# Altium project canopy_cam.PrjPCB
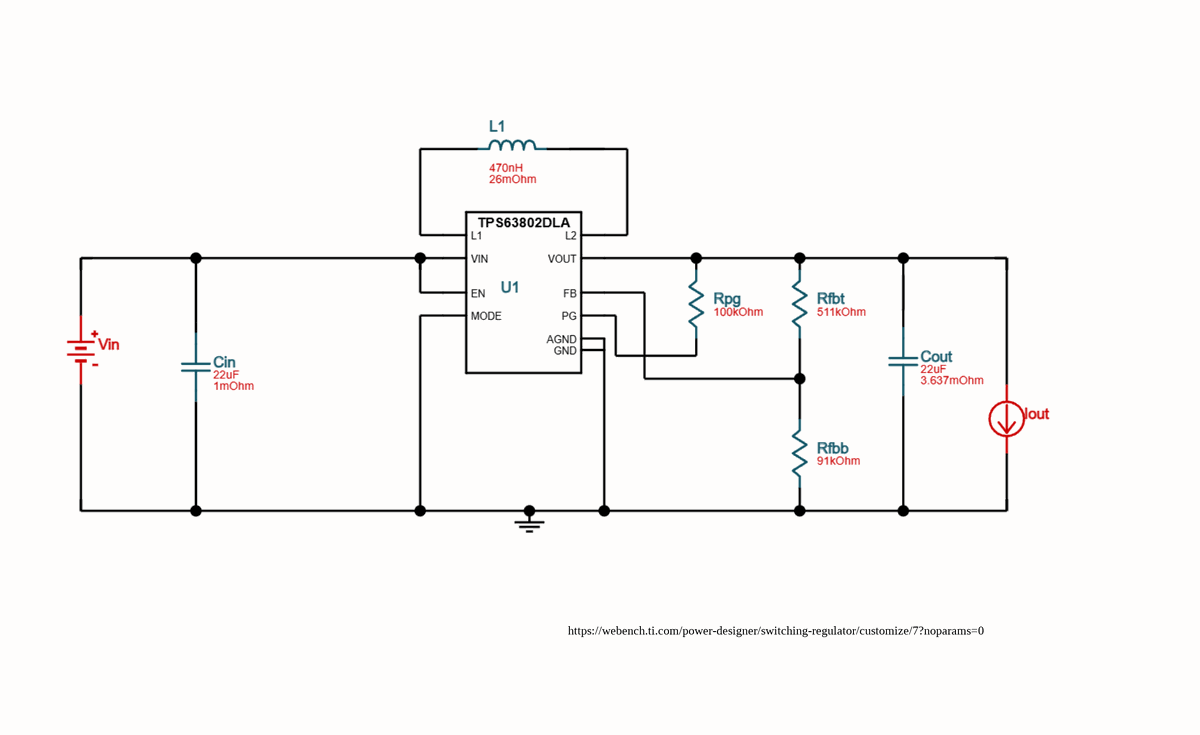
[diagram p0: solar_power.SchDoc, left]
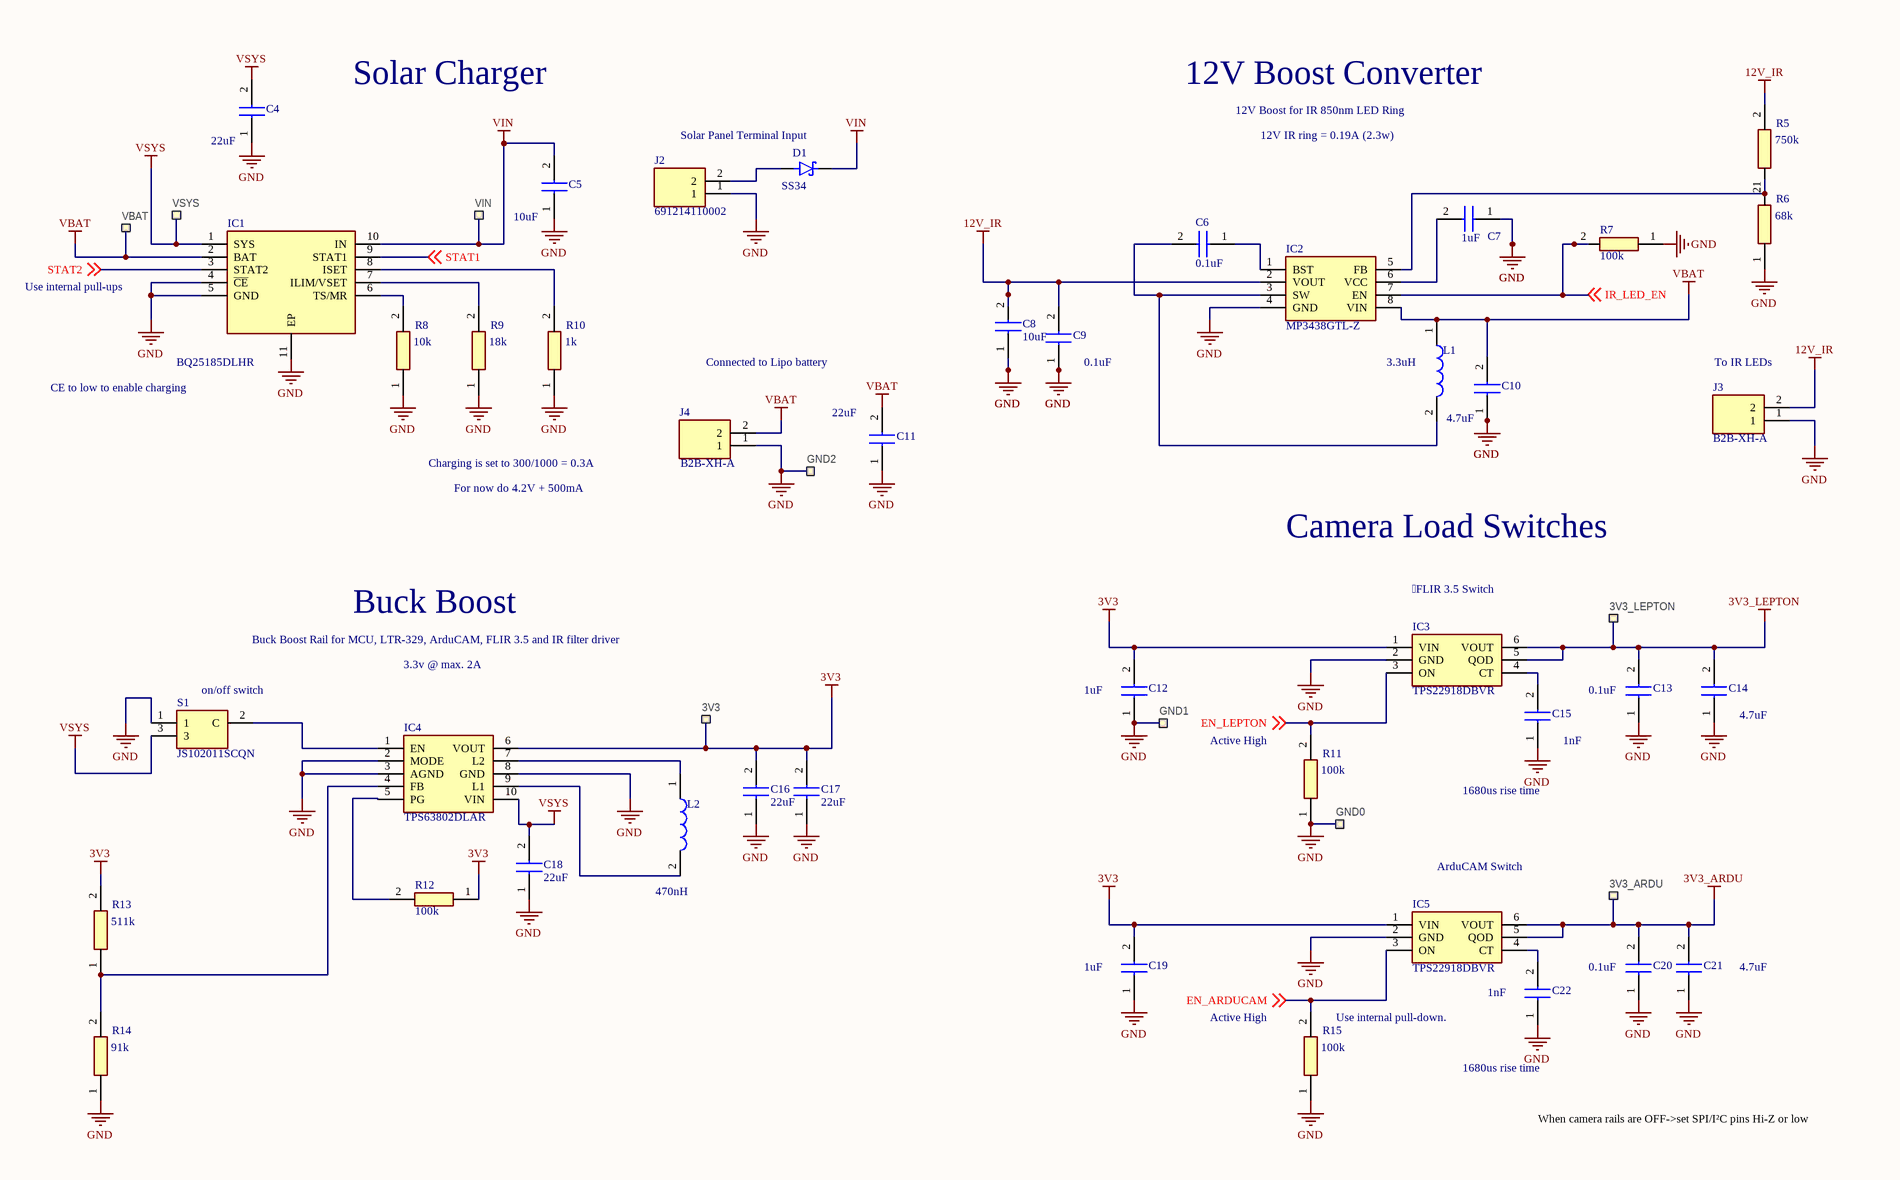
[diagram p1: solar_power.SchDoc, right]
BoardThickness: 1.6mm; BoardTitle: nRF52840 Development Board; Classification: Public; Compliance: RoHS, REACH, Halogen-Free; Designer: MASI/RUBR/STL1/RSK; Dielectric: FR-4 Halogen-Free; NrOfLayers: 4; Organization: Nordic Semiconductor; PCAName: PCA10056; PCARevision: 3.0.3; PCBNumber: 400236; PCBRevision: 0461RUBR; PCBStackup: 4001: Standard 1.6mm 1oz; ProductName: nRF52840-DK; ProjectName: nRF52840-DK; ProjectNumber: 4440; SilkscreenColor: White; SoldermaskColor: Blue; SurfaceFinish: ENIG
3 sheets, 70 parts. Net scope: flat (ports and power ports of the same name join across sheets).
Board file: canopy_cam.PcbDoc
Sheets:
  solar_power.SchDoc
  connectors.SchDoc
  nRF52840.SchDoc

## Sheet solar_power.SchDoc
size B

### Parts
3V3  Ø1.0mm,SMD  [TP_SMD_D1.0mm]  (value not drawn)  (no BOM)
3V3_ARDU  Ø1.0mm,SMD  [TP_SMD_D1.0mm]  (value not drawn)  (no BOM)
3V3_LEPTON  Ø1.0mm,SMD  [TP_SMD_D1.0mm]  (value not drawn)  (no BOM)
C4  22uF  [CAPC2114X95N]
C5  10uF  [CAPC2114X95N]
C6  0.1uF  [CAPC1608X90N]
C7  1uF  [CAPC1608X90N]
C8  10uF  [CAPC2114X95N]
C9  0.1uF  [CAPC1608X90N]
C10  4.7uF  [CAPC2114X95N]
C11  22uF  [CAPC2114X95N]
C12  1uF  [CAPC1608X90N]
C13  0.1uF  [CAPC1608X90N]
C14  4.7uF  [CAPC1608X90N]
C15  1nF  [CAPC1608X90N]
C16  22uF  [CAPC2114X95N]
C17  22uF  [CAPC2114X95N]
C18  22uF  [CAPC2114X95N]
C19  1uF  [CAPC1608X90N]
C20  0.1uF  [CAPC1608X90N]
C21  4.7uF  [CAPC1608X90N]
C22  1nF  [CAPC1608X90N]
D1  SS34  [DIOM7959X265N]
GND0  Ø1.0mm,SMD  [TP_SMD_D1.0mm]  (value not drawn)  (no BOM)
GND1  Ø1.0mm,SMD  [TP_SMD_D1.0mm]  (value not drawn)  (no BOM)
GND2  Ø1.0mm,SMD  [TP_SMD_D1.0mm]  (value not drawn)  (no BOM)
IC1  BQ25185DLHR  [SON40P220X200X80-11N]
IC2  MP3438GTL-Z  [SOTFL50P160X60-8N]
IC3  TPS22918DBVR  [SOT95P280X145-6N]
IC4  TPS63802DLAR  [TPS63802DLAR]
IC5  TPS22918DBVR  [SOT95P280X145-6N]
J2  691214110002  [691214110002]
J3  B2B-XH-A  [SHDR2W64P0X250_1X2_740X575X700P]
J4  B2B-XH-A  [SHDR2W64P0X250_1X2_740X575X700P]
L1  3.3uH  [MPLAL40203R3]
L2  470nH  [1285ASH1R0MP2]
R5  750k  [RESC1608X55N]
R6  68k  [RESC1608X55N]
R7  100k  [RESC1608X55N]
R8  10k  [RESC1608X55N]
R9  18k  [RESC1608X55N]
R10  1k  [RESC1608X55N]
R11  100k  [RESC1608X55N]
R12  100k  [RESC1608X55N]
R13  511k  [RESC1608X55N]
R14  91k  [RESC1608X55N]
R15  100k  [RESC1608X55N]
S1  JS102011SCQN  [JS102011SCQN]
VBAT  Ø1.0mm,SMD  [TP_SMD_D1.0mm]  (value not drawn)  (no BOM)
VIN  Ø1.0mm,SMD  [TP_SMD_D1.0mm]  (value not drawn)  (no BOM)
VSYS  Ø1.0mm,SMD  [TP_SMD_D1.0mm]  (value not drawn)  (no BOM)

### Nets
3V3: 3V3.1 C12.2 C16.2 C17.2 C19.2 IC3.1(VIN) IC4.6(VOUT) IC5.1(VIN) R12.1 R13.2
3V3_ARDU: 3V3_ARDU.1 C20.2 C21.2 IC5.5(QOD) IC5.6(VOUT)
3V3_LEPTON: 3V3_LEPTON.1 C13.2 C14.2 IC3.5(QOD) IC3.6(VOUT)
12V_IR: C8.2 C9.2 IC2.2(VOUT) J3.2 R5.2
GND: C4.1 C5.1 C7.1 C8.1 C9.1 C10.1 C11.1 C12.1 C13.1 C14.1 C15.1 C16.1 C17.1 C18.1 C19.1 C20.1 C21.1 C22.1 GND0.1 GND1.1 GND2.1 IC1.4(~{CE}) IC1.5(GND) IC1.11(EP) IC2.4(GND) IC3.2(GND) IC4.2(MODE) IC4.3(AGND) IC4.8(GND) IC5.2(GND) J2.1 J3.1 J4.1 R6.1 R7.1 R8.1 R9.1 R10.1 R11.1 R14.1 R15.1 S1.1
VBAT: C10.2 C11.2 IC1.2(BAT) IC2.8(VIN) J4.2 L1.1 VBAT.1
VIN: C5.2 D1.C(K) IC1.10(IN) VIN.1
VSYS: C4.2 C18.2 IC1.1(SYS) IC4.10(VIN) S1.3 VSYS.1
EN_ARDUCAM: IC5.3(ON) R15.2 ; off-sheet EN_ARDUCAM  [project net P0.30]
EN_LEPTON: IC3.3(ON) R11.2 ; off-sheet EN_LEPTON  [project net P0.03]
IR_LED_EN: IC2.7(EN) R7.2 ; off-sheet IR_LED_EN  [project net P0.31]
STAT1: IC1.9(STAT1) ; off-sheet STAT1  [project net P0.28]
STAT2: IC1.3(STAT2) ; off-sheet STAT2  [project net P0.02]
NetC6_1: C6.1 IC2.1(BST)
NetC6_2: C6.2 IC2.3(SW) L1.2
NetC7_2: C7.2 IC2.6(VCC)
NetC15_2: C15.2 IC3.4(CT)
NetC22_2: C22.2 IC5.4(CT)
NetD1_A: D1.A J2.2
NetIC1_6: IC1.6(TS/MR) R8.2
NetIC1_7: IC1.7(ILIM/VSET) R9.2
NetIC1_8: IC1.8(ISET) R10.2
NetIC2_5: IC2.5(FB) R5.1 R6.2
NetIC4_1: IC4.1(EN) S1.2(C)
NetIC4_4: IC4.4(FB) R13.1 R14.2
NetIC4_5: IC4.5(PG) R12.2
NetIC4_7: IC4.7(L2) L2.1
NetIC4_9: IC4.9(L1) L2.2

### Notes on the sheet
- Solar Charger
- Solar Panel Terminal Input
- 12V Boost Converter
- 12V Boost for IR 850nm LED Ring
- 12V IR ring = 0.19A (2.3w)
- Use internal pull-ups
- (near IC1) CE to low to enable charging
- Connected to Lipo battery
- (near J3) To IR LEDs
- Charging is set to 300/1000 = 0.3A
- For now do 4.2V + 500mA
- Camera Load Switches
- Buck Boost Rail for MCU, LTR-329, ArduCAM, FLIR 3.5 and IR filter driver
- Buck Boost
- (near IC3) FLIR 3.5 Switch
- (near S1) on/off switch
- 3.3v @ max. 2A
- Active High
- 1680us rise time
- (near IC5) ArduCAM Switch
- https://webench.ti.com/power-designer/switching-regulator/customize/7?noparams=0
- (near R15) Active High
- (near R15) Use internal pull-down.
- When camera rails are OFF->set SPI/I²C pins Hi-Z or low

### Library data of the parts
3V3 3V3_ARDU 3V3_LEPTON GND0-GND2 VBAT VIN VSYS = TP_SMD_Ø1.0MM: 1.0mm circular SMD testpad; Manufacturer: Nordic Semiconductor; Manufacturer Part Number: N.A.; Part number NEMS: 100500475; Pad Count: 1; Component Status: Active; Part Number: TP_SMD_Ø1.0MM; LatestRevisionDate: 2021-03-05; Published: 2013-06-11; Value: Ø1.0mm,SMD; Note: N.A.; Artikkelnr Noca: N.A.; Footprint Doc: TP_SMD_Ø1.0mm; Part number IPS: N.A.; ComponentLink1URL: N.A.; ComponentLink1Description: Datasheet; ComponentLink2URL: N.A.; ComponentLink2Description: Supplier link; HelpURL: N.A.; Supplier 1: N.A.; Supplier Part Number 1: N.A.; Supplier 2: N.A.; Supplier Part Number 2: N.A.; Author: rsk; Component Class: Connectors; PartId: 100500475; Part number Norautron: N.A.
C4 C5 C8 C10 C11 C16-C18 = MSASL219LB5226MTNA01: MSASL219LB5226MTNA01 0805 CAP 25V; Manufacturer_Name: TAIYO YUDEN; Datasheet Link: https://4donline.ihs.com/images/VipMasterIC/IC/TAIY/TAIY-S-A0026212580/TAIY-S-A0026212609-1.pdf?hkey=61A2E4C270F0397D049F8F05BD4F1054; Height: 0.95mm; Manufacturer_Part_Number: MSASL219LB5226MTNA01
C6 C7 C9 C12-C14 C19-C21 = CC0603KRX7R0BB104: 0603 CAP X5R 25V; Manufacturer_Name: YAGEO; Datasheet Link: https://www.yageo.com/upload/media/product/products/datasheet/mlcc/UPY-NP0X7R_MV_100-to-630V_21.pdf; Height: 0.9mm; Manufacturer_Part_Number: CC0603KRX7R0BB104; Mouser Part Number: 603-CC603KRX7R0BB104; Mouser Price/Stock: https://www.mouser.co.uk/ProductDetail/YAGEO/CC0603KRX7R0BB104?qs=5eucE5Hus%252BjO6dm3Y8T6pg%3D%3D; Arrow Part Number: CC0603KRX7R0BB104; Arrow Price/Stock: https://www.arrow.com/en/products/cc0603krx7r0bb104/yageo?region=nac
C15 C22 = CC0603KRX7R0BB104: 0603 CAP X5R 50V; Manufacturer_Name: YAGEO; Datasheet Link: https://www.yageo.com/upload/media/product/products/datasheet/mlcc/UPY-NP0X7R_MV_100-to-630V_21.pdf; Height: 0.9mm; Manufacturer_Part_Number: CC0603KRX7R0BB104; Mouser Part Number: 603-CC603KRX7R0BB104; Mouser Price/Stock: https://www.mouser.co.uk/ProductDetail/YAGEO/CC0603KRX7R0BB104?qs=5eucE5Hus%252BjO6dm3Y8T6pg%3D%3D; Arrow Part Number: CC0603KRX7R0BB104; Arrow Price/Stock: https://www.arrow.com/en/products/cc0603krx7r0bb104/yageo?region=nac
D1 = SS34: Diode Schottky 40 V 3A Surface Mount SMC (DO-214AB); MF: onsemi; SnapEDA_Link: https://www.snapeda.com/parts/SS34/Onsemi/view-part/?ref=snap; Package: SMC-2 ON Semiconductor; Value: *; MP: SS34; Check_prices: https://www.snapeda.com/parts/SS34/Onsemi/view-part/?ref=eda
IC1 = BQ25185DLHR: Integrated Circuit; Manufacturer_Name: Texas Instruments; Datasheet Link: https://www.ti.com/lit/ds/symlink/bq25185.pdf?ts=1706857561339&ref_url=https%253A%252F%252Fwww.ti.com%252Fproduct%252FBQ25185; Height: 0.8mm; Manufacturer_Part_Number: BQ25185DLHR; Mouser Part Number: 595-BQ25185DLHR; Mouser Price/Stock: https://www.mouser.co.uk/ProductDetail/Texas-Instruments/BQ25185DLHR?qs=Z%252BL2brAPG1IbO%2FV3RqsaPw%3D%3D
IC2 = MP3438GTL-Z: Integrated Circuit; Manufacturer_Name: Monolithic Power Systems (MPS); Datasheet Link: https://www.monolithicpower.com/en/documentview/productdocument/index/version/2/document_type/Datasheet/lang/en/sku/MP3438GTL/; Height: 0.6mm; Manufacturer_Part_Number: MP3438GTL-Z; Mouser Part Number: 946-MP3438GTL-Z; Mouser Price/Stock: https://www.mouser.co.uk/ProductDetail/Monolithic-Power-Systems-MPS/MP3438GTL-Z?qs=tlsG%2FOw5FFjfFO8TaWv5UA%3D%3D
IC3 IC5 = TPS22918DBVR: Integrated Circuit; Manufacturer_Name: Texas Instruments; Datasheet Link: http://www.ti.com/lit/gpn/TPS22918; Height: 1.45mm; Manufacturer_Part_Number: TPS22918DBVR; Mouser Part Number: 595-TPS22918DBVR; Mouser Price/Stock: https://www.mouser.co.uk/ProductDetail/Texas-Instruments/TPS22918DBVR?qs=f4l5qYp%2Fy%252B5F7w5ZAgmi7A%3D%3D; Arrow Part Number: TPS22918DBVR; Arrow Price/Stock: https://www.arrow.com/en/products/tps22918dbvr/texas-instruments?utm_currency=USD&region=nac
IC4 = TPS63802DLAR: Integrated Circuit; Manufacturer_Name: Texas Instruments; Datasheet Link: http://www.ti.com/lit/ds/symlink/tps63802.pdf; Height: 1mm; Manufacturer_Part_Number: TPS63802DLAR; Mouser Part Number: 595-TPS63802DLAR; Mouser Price/Stock: https://www.mouser.co.uk/ProductDetail/Texas-Instruments/TPS63802DLAR?qs=9r4v7xj2Lnmr2ylyTiX9Mg%3D%3D; Arrow Part Number: TPS63802DLAR; Arrow Price/Stock: https://www.arrow.com/en/products/tps63802dlar/texas-instruments?utm_currency=USD&region=nac
J2 = 691214110002: Connector; Manufacturer_Name: Wurth Elektronik; Datasheet Link: https://www.we-online.com/components/products/download/3D_691214110002+%28rev1%29.pdf; Height: 8.7mm; Manufacturer_Part_Number: 691214110002; Mouser Part Number: 710-691214110002; Mouser Price/Stock: https://www.mouser.co.uk/ProductDetail/Wurth-Elektronik/691214110002?qs=7gQLVZk5cPmb9EqUyfv%252B2g%3D%3D
J3 J4 = B2B-XH-A: Connector; Manufacturer_Name: JST (JAPAN SOLDERLESS TERMINALS); Datasheet Link: https://order.jst-mfg.com/InternetShop/app/pdf_show.php?kbn=3&key=XH%20CONNECTOR%20THROUGH-HOLE%20TYPE%20SHROUDED%20HEADER.pdf; Height: 7mm; Manufacturer_Part_Number: B2B-XH-A
L1 = MPL-AL4020-3R3: Manufacturer_Name: Monolithic Power Systems (MPS); Datasheet Link: https://www.monolithicpower.com/en/documentview/productdocument/index/version/2/document_type/Datasheet/lang/en/sku/MPL-AL4020-3R3/document_id/5795/; Height: 2.1mm; Manufacturer_Part_Number: MPL-AL4020-3R3; Mouser Part Number: 946-MPL-AL4020-3R3; Mouser Price/Stock: https://www.mouser.co.uk/ProductDetail/Monolithic-Power-Systems-MPS/MPL-AL4020-3R3?qs=sPbYRqrBIVnE90fmE2PrGQ%3D%3D
L2 = DFE201610E-R47M=P2: Manufacturer_Name: Murata Electronics; Datasheet Link: https://search.murata.co.jp/Ceramy/image/img/P02/J(E)TE243A-0001.pdf; Height: 1mm; Manufacturer_Part_Number: DFE201610E-R47M=P2; Mouser Part Number: 81-DFE201610E-R47MP2; Mouser Price/Stock: https://www.mouser.co.uk/ProductDetail/Murata-Electronics/DFE201610E-R47M%3dP2?qs=AQlKX63v8RtBvyqMdluN2g%3D%3D; Arrow Part Number: DFE201610E-R47M=P2; Arrow Price/Stock: https://www.arrow.com/en/products/dfe201610e-r47mp2/murata-manufacturing?utm_currency=USD&region=nac
R5 R6 = RC0603FR0710KL: Resistor SMD 0603 1% 0.25W; Manufacturer_Name: YAGEO; Datasheet Link: http://www.yageo.com/documents/recent/PYu-RC0603_51_RoHS_L_v5.pdf; Height: 0.55mm; Manufacturer_Part_Number: RC0603FR0710KL; Arrow Part Number: RC0603FR0710KL; Arrow Price/Stock: https://www.arrow.com/en/products/rc0603fr-0710kl/yageo
R7 R11 R12 R15 = RC0603FR0710KL: Resistor SMD 0603 1% 0.1W; Manufacturer_Name: YAGEO; Datasheet Link: http://www.yageo.com/documents/recent/PYu-RC0603_51_RoHS_L_v5.pdf; Height: 0.55mm; Manufacturer_Part_Number: RC0603FR0710KL; Arrow Part Number: RC0603FR0710KL; Arrow Price/Stock: https://www.arrow.com/en/products/rc0603fr-0710kl/yageo
R8-R10 R13 R14 = RC0603FR0710KL: Resistor SMD 0603 1% 1/10; Manufacturer_Name: YAGEO; Datasheet Link: http://www.yageo.com/documents/recent/PYu-RC0603_51_RoHS_L_v5.pdf; Height: 0.55mm; Manufacturer_Part_Number: RC0603FR0710KL; Arrow Part Number: RC0603FR0710KL; Arrow Price/Stock: https://www.arrow.com/en/products/rc0603fr-0710kl/yageo
S1 = JS102011SCQN: Switch; Manufacturer_Name: C & K COMPONENTS; Datasheet Link: https://www.ckswitches.com/media/1422/js.pdf; Height: 5mm; Manufacturer_Part_Number: JS102011SCQN; Mouser Part Number: 611-JS102011SCQN; Mouser Price/Stock: https://www.mouser.co.uk/ProductDetail/CK/JS102011SCQN?qs=aIxPIZZxLh%2FC%2Fw7UJtfwsg%3D%3D; Arrow Part Number: JS102011SCQN; Arrow Price/Stock: https://www.arrow.com/en/products/js102011scqn/ck?utm_currency=USD&region=nac

## Sheet connectors.SchDoc
size A
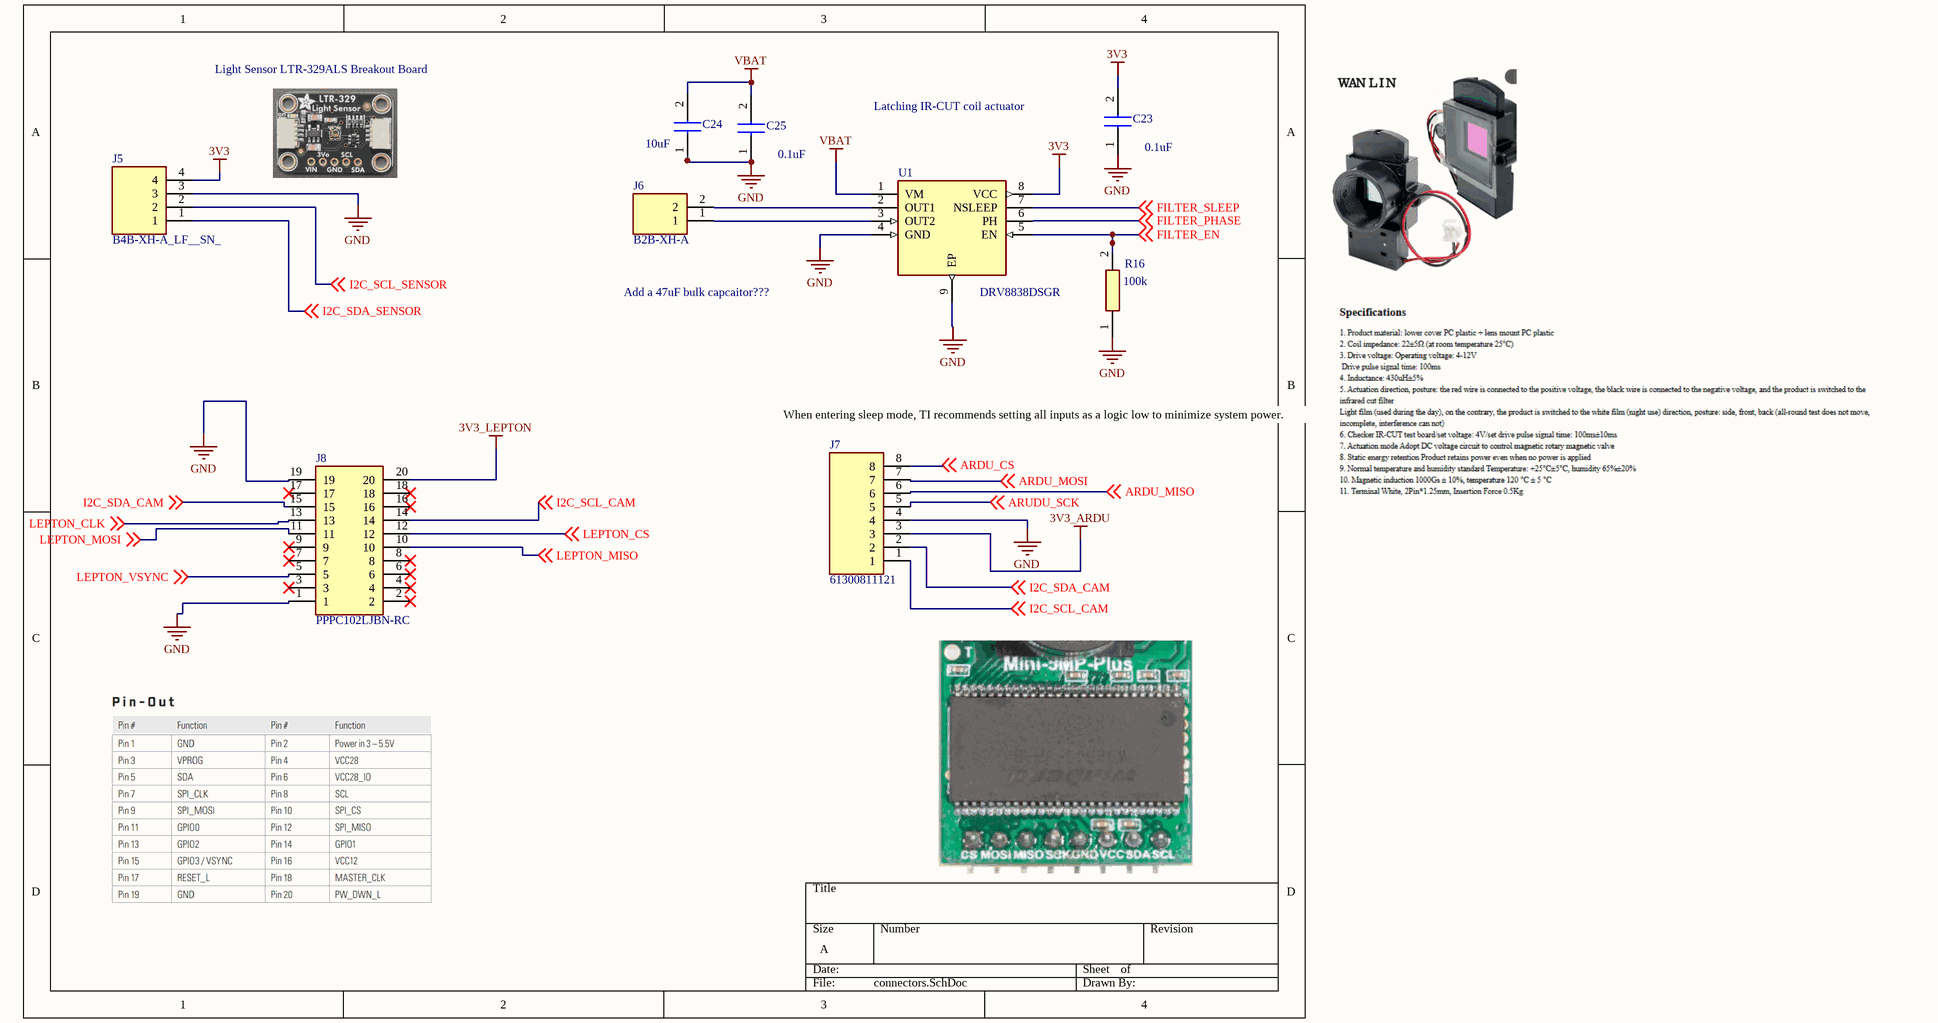
[diagram p2: connectors.SchDoc]

### Parts
C23  0.1uF  [CAPC1608X90N]
C24  10uF  [CAPC1608X90N]
C25  0.1uF  [CAPC1608X90N]
J5  B4B-XH-A_LF__SN_  [B4BXHALFSN]
J6  B2B-XH-A  [SHDR2W64P0X250_1X2_740X575X700P]
J7  61300811121  [HDRV8W64P0X254_1X8_2032X254X854P]
J8  PPPC102LJBN-RC  [RHDRRA20W60P254X254_2X10_2590X508X850P]
R16  100k  [RESC1608X55N]
U1  DRV8838DSGR  [SON50P200X200X80-9N]

### Nets
3V3: C23.2 J5.4 U1.8(VCC)
3V3_ARDU: J7.3
3V3_LEPTON: J8.20
GND: C23.1 C24.1 C25.1 J5.3 J7.4 J8.1 J8.19 R16.1 U1.4(GND) U1.9(EP)
VBAT: C24.2 C25.2 U1.1(VM)
ARDU_CS: J7.8 ; off-sheet ARDU_CS  [project net P1.08]
ARDU_MISO: J7.6 ; off-sheet ARDU_MISO  [project net P0.07]
ARDU_MOSI: J7.7 ; off-sheet ARDU_MOSI  [project net P0.08]
ARUDU_SCK: J7.5 ; off-sheet ARUDU_SCK  [project net P0.06]
FILTER_EN: R16.2 U1.5(EN) ; off-sheet FILTER_EN  [project net P0.29]
FILTER_PHASE: U1.6(PH) ; off-sheet FILTER_PHASE  [project net P1.15]
FILTER_SLEEP: U1.7(NSLEEP) ; off-sheet FILTER_SLEEP  [project net P1.14]
I2C_SCL_CAM: J7.1 J8.14 ; off-sheet I2C_SCL_CAM  [project net SCL]
I2C_SCL_SENSOR: J5.2 ; off-sheet I2C_SCL_SENSOR  [project net SCL_SENSOR]
I2C_SDA_CAM: J7.2 J8.15 ; off-sheet I2C_SDA_CAM  [project net SDA]
I2C_SDA_SENSOR: J5.1 ; off-sheet I2C_SDA_SENSOR  [project net SDA_SENSOR]
LEPTON_CLK: J8.13 ; off-sheet LEPTON_CLK  [project net P0.12]
LEPTON_CS: J8.12 ; off-sheet LEPTON_CS  [project net P0.14]
LEPTON_MISO: J8.10 ; off-sheet LEPTON_MISO  [project net P0.16]
LEPTON_MOSI: J8.11 ; off-sheet LEPTON_MOSI  [project net P0.13]
LEPTON_VSYNC: J8.5 ; off-sheet LEPTON_VSYNC  [project net P0.15]
NetJ6_1: J6.1 U1.3(OUT2)
NetJ6_2: J6.2 U1.2(OUT1)

Not connected (* = marked no-connect by the designer): J8 2* 3* 4* 6* 7* 8* 9* 16* 17* 18*

### Notes on the sheet
- Light Sensor LTR-329ALS Breakout Board
- Latching IR-CUT coil actuator
- Add a 47uF bulk capcaitor???
- (near J7) When entering sleep mode, TI recommends setting all inputs as a logic low to minimize system power.

### Library data of the parts
C23-C25 = CC0603KRX7R0BB104: as C6 on sheet solar_power; Datasheet Link: https://www.yageo.com/upload/media/product/products/datasheet/mlcc/UPY-NP0X7R_MV_100-to-630V_21.pdf; Height: 0.9mm; Manufacturer_Part_Number: CC0603KRX7R0BB104; Mouser Part Number: 603-CC603KRX7R0BB104; Mouser Price/Stock: https://www.mouser.co.uk/ProductDetail/YAGEO/CC0603KRX7R0BB104?qs=5eucE5Hus%252BjO6dm3Y8T6pg%3D%3D; Arrow Part Number: CC0603KRX7R0BB104; Arrow Price/Stock: https://www.arrow.com/en/products/cc0603krx7r0bb104/yageo?region=nac
J5 = B4B-XH-A_LF__SN_: Connector; Manufacturer_Name: JST (JAPAN SOLDERLESS TERMINALS); Manufacturer_Part_Number: B4B-XH-A(LF)(SN); Datasheet Link: https://datasheet.lcsc.com/szlcsc/JST-Sales-America-B4B-XH-A-LF-SN_C144395.pdf; Height: 7mm; Mouser Part Number: 306-B4BXHALFSN; Mouser Price/Stock: https://www.mouser.co.uk/ProductDetail/JST-Commercial/B4B-XH-ALFSN?qs=cdbOS8ANM9CfC08d%252BywhFw%3D%3D; Arrow Part Number: B4B-XH-A(LF)(SN); Arrow Price/Stock: https://www.arrow.com/en/products/b4b-xh-a-lf-sn/jst-manufacturing?utm_currency=USD&region=europe
J6 = B2B-XH-A: as J3 on sheet solar_power; Datasheet Link: https://order.jst-mfg.com/InternetShop/app/pdf_show.php?kbn=3&key=XH%20CONNECTOR%20THROUGH-HOLE%20TYPE%20SHROUDED%20HEADER.pdf; Height: 7mm; Manufacturer_Part_Number: B2B-XH-A
J7 = 61300811121: Connector; Manufacturer_Name: Wurth Elektronik; Datasheet Link: https://www.we-online.com/components/products/download/3D_61300811121+%28rev1%29.pdf; Height: 8.54mm; Manufacturer_Part_Number: 61300811121; Mouser Part Number: 710-61300811121; Mouser Price/Stock: https://www.mouser.co.uk/ProductDetail/Wurth-Elektronik/61300811121?qs=PhR8RmCirEZRdx%252BVlEmRRA%3D%3D
J8 = PPPC102LJBN-RC: Connector; Manufacturer_Name: Sullins; Datasheet Link: https://drawings-pdf.s3.amazonaws.com/10494.pdf; Height: 8.5mm; Manufacturer_Part_Number: PPPC102LJBN-RC
R16 = RC0603FR0710KL: as R7 on sheet solar_power; Datasheet Link: http://www.yageo.com/documents/recent/PYu-RC0603_51_RoHS_L_v5.pdf; Height: 0.55mm; Manufacturer_Part_Number: RC0603FR0710KL; Arrow Part Number: RC0603FR0710KL; Arrow Price/Stock: https://www.arrow.com/en/products/rc0603fr-0710kl/yageo
U1 = DRV8838DSGR: Undefined or Miscellaneous; Manufacturer_Name: Texas Instruments; Datasheet Link: http://www.ti.com/lit/ds/symlink/drv8838.pdf; Height: 0.8mm; Manufacturer_Part_Number: DRV8838DSGR; Mouser Part Number: 595-DRV8838DSGR; Mouser Price/Stock: https://www.mouser.co.uk/ProductDetail/Texas-Instruments/DRV8838DSGR?qs=6E8igxPflKdSnWcv9OHrUQ%3D%3D; Arrow Part Number: DRV8838DSGR; Arrow Price/Stock: https://www.arrow.com/en/products/drv8838dsgr/texas-instruments?utm_currency=USD&region=nac

## Sheet nRF52840.SchDoc: =BoardTitle + ' - nRF52840 MCU'
size B; Organization: Nordic Semiconductor; DocumentNumber: 2; Revision: 3.0.3; SheetNumber: 2; SheetTotal: 6; Author: MASI/RUBR/STL1/RSK; CompanyName: Nordic Semiconductor; DrawnBy: MASI/RUBR/STL1/RSK; DocumentSize: A3; ProjectName: nRF52840-DK
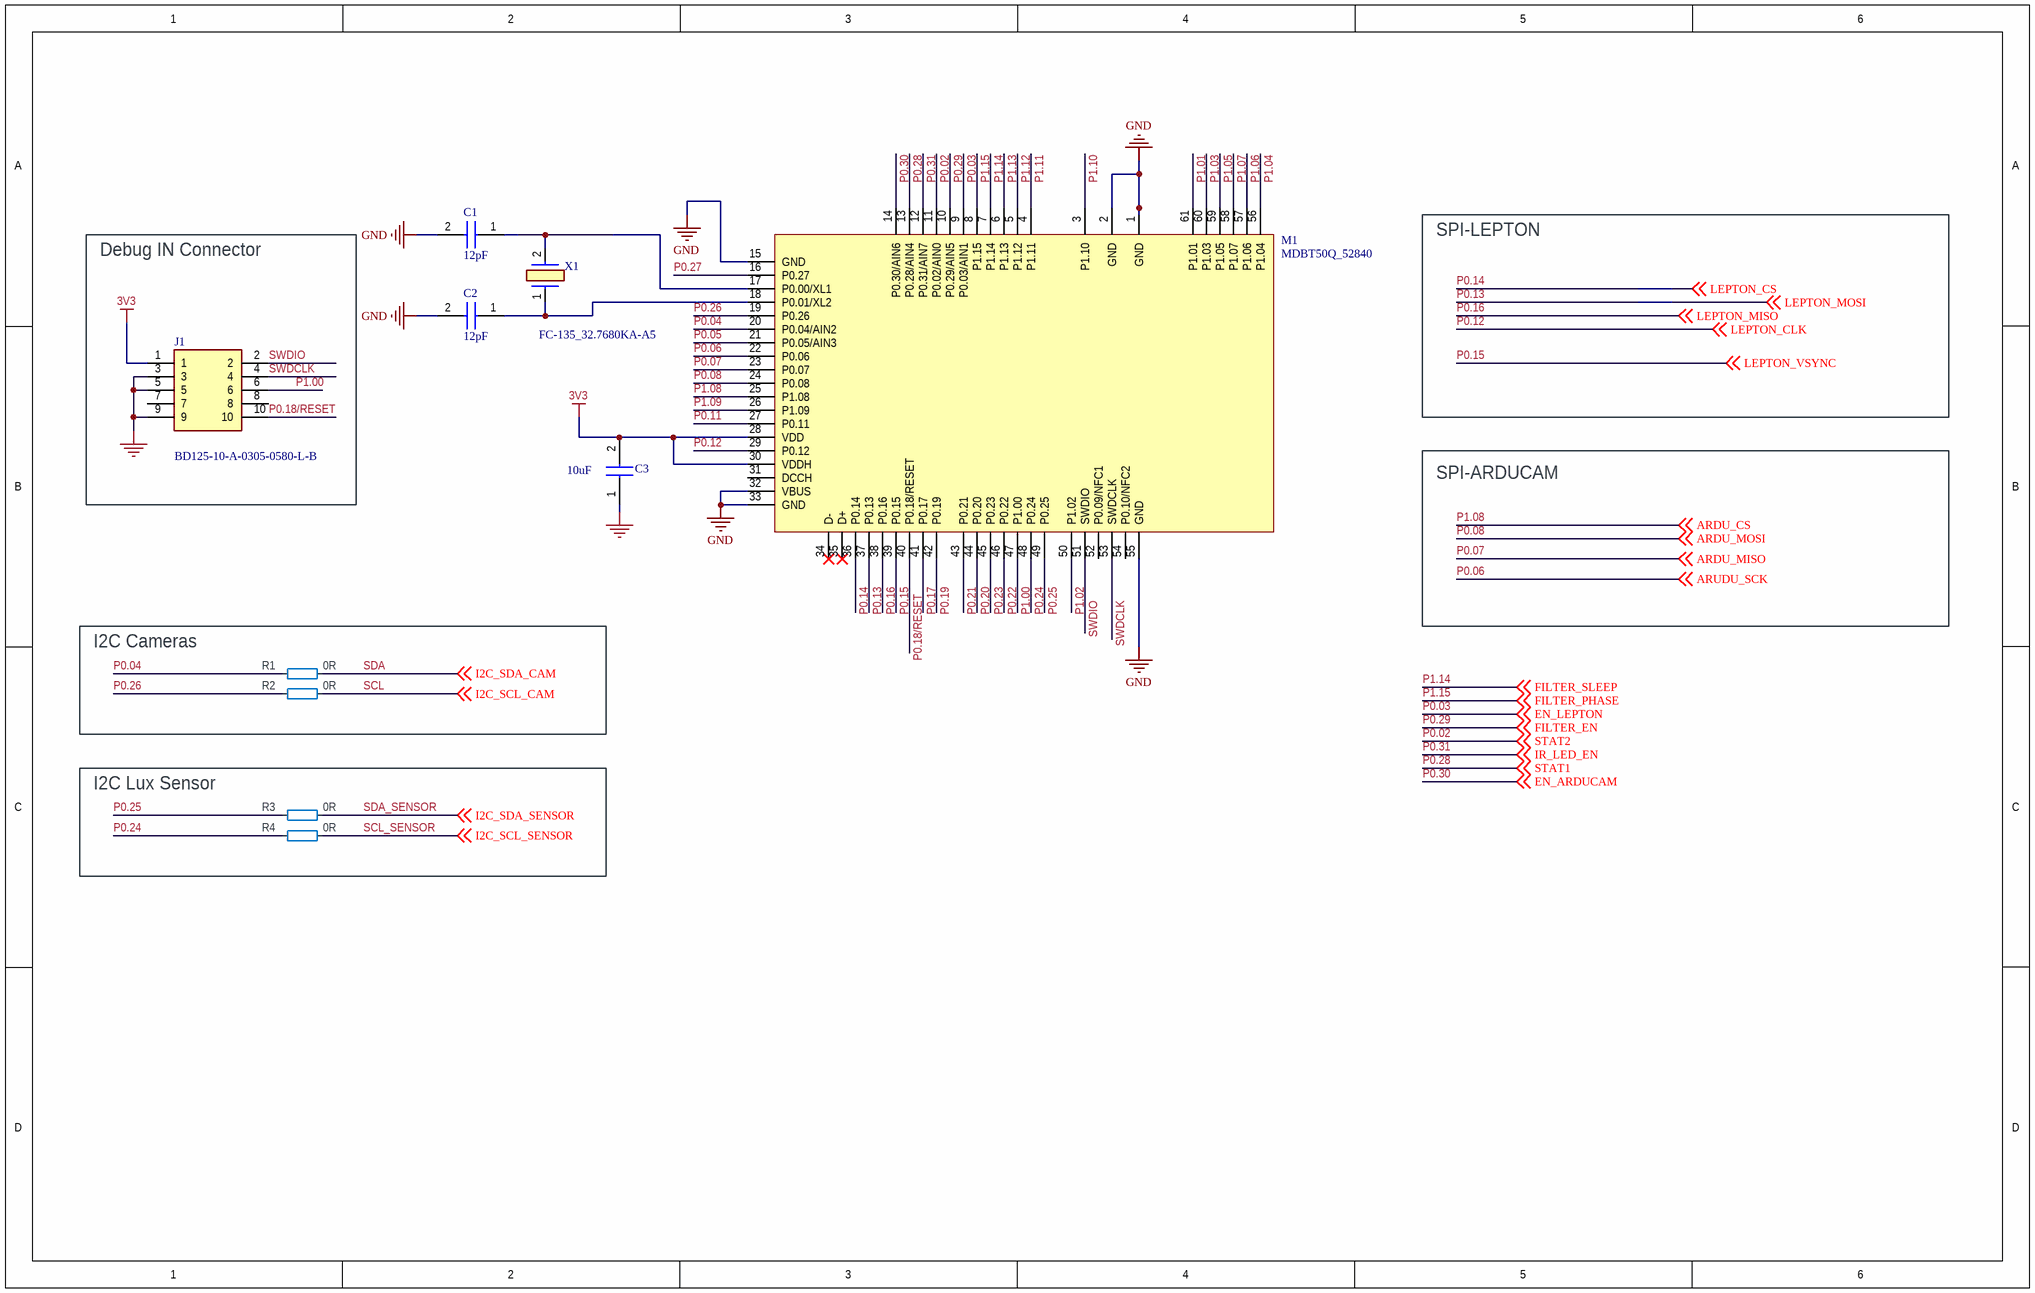
[diagram p3: nRF52840.SchDoc]

### Parts
C1  12pF  [CAPC1608X90N]
C2  12pF  [CAPC1608X90N]
C3  10uF  [CAPC1608X90N]
J1  BD125-10-A-0305-0580-L-B  [BD12510A03050580LB]
M1  MDBT50Q_52840  [MDBT50Q]
R1  0R  [RESC0603X03L_C]
R2  0R  [RESC0603X03L_C]
R3  0R  [RESC0603X03L_C]
R4  0R  [RESC0603X03L_C]
X1  FC-135_32.7680KA-A5  [FC135327680KAA5]

### Blocks framed on the sheet
Debug IN Connector: J1
I2C Cameras: R1 R2
I2C Lux Sensor: R3 R4

### Nets
3V3: C3.2 J1.1 M1.28(VDD) M1.30(VDDH)
GND: C1.2 C2.2 C3.1 J1.3 J1.5 J1.9 M1.1(GND) M1.2(GND) M1.15(GND) M1.32(VBUS) M1.33(GND) M1.55(GND)
P0.02: M1.11(P0.02/AIN0) ; off-sheet STAT2  [also labelled STAT2]
P0.03: M1.9(P0.03/AIN1) ; off-sheet EN_LEPTON  [also labelled EN_LEPTON]
P0.04: M1.20(P0.04/AIN2) R1.2
P0.05: M1.21(P0.05/AIN3)
P0.06: M1.22(P0.06) ; off-sheet ARUDU_SCK  [also labelled ARUDU_SCK]
P0.07: M1.23(P0.07) ; off-sheet ARDU_MISO  [also labelled ARDU_MISO]
P0.08: M1.24(P0.08) ; off-sheet ARDU_MOSI  [also labelled ARDU_MOSI]
P0.11: M1.27(P0.11)
P0.12: M1.29(P0.12) ; off-sheet LEPTON_CLK  [also labelled LEPTON_CLK]
P0.13: M1.37(P0.13) ; off-sheet LEPTON_MOSI  [also labelled LEPTON_MOSI]
P0.14: M1.36(P0.14) ; off-sheet LEPTON_CS  [also labelled LEPTON_CS]
P0.15: M1.39(P0.15) ; off-sheet LEPTON_VSYNC  [also labelled LEPTON_VSYNC]
P0.16: M1.38(P0.16) ; off-sheet LEPTON_MISO  [also labelled LEPTON_MISO]
P0.17: M1.41(P0.17)
P0.18/RESET: J1.10 M1.40(P0.18/RESET)
P0.19: M1.42(P0.19)
P0.20: M1.44(P0.20)
P0.21: M1.43(P0.21)
P0.22: M1.46(P0.22)
P0.23: M1.45(P0.23)
P0.24: M1.48(P0.24) R4.2
P0.25: M1.49(P0.25) R3.2
P0.26: M1.19(P0.26) R2.2
P0.27: M1.16(P0.27)
P0.28: M1.13(P0.28/AIN4) ; off-sheet STAT1  [also labelled STAT1]
P0.29: M1.10(P0.29/AIN5) ; off-sheet FILTER_EN  [also labelled FILTER_EN]
P0.30: M1.14(P0.30/AIN6) ; off-sheet EN_ARDUCAM  [also labelled EN_ARDUCAM]
P0.31: M1.12(P0.31/AIN7) ; off-sheet IR_LED_EN  [also labelled IR_LED_EN]
P1.00: J1.6 M1.47(P1.00)
P1.01: M1.61(P1.01)
P1.02: M1.50(P1.02)
P1.03: M1.60(P1.03)
P1.04: M1.56(P1.04)
P1.05: M1.59(P1.05)
P1.06: M1.57(P1.06)
P1.07: M1.58(P1.07)
P1.08: M1.25(P1.08) ; off-sheet ARDU_CS  [also labelled ARDU_CS]
P1.09: M1.26(P1.09)
P1.10: M1.3(P1.10)
P1.11: M1.4(P1.11)
P1.12: M1.5(P1.12)
P1.13: M1.6(P1.13)
P1.14: M1.7(P1.14) ; off-sheet FILTER_SLEEP  [also labelled FILTER_SLEEP]
P1.15: M1.8(P1.15) ; off-sheet FILTER_PHASE  [also labelled FILTER_PHASE]
SCL: R2.1 ; off-sheet I2C_SCL_CAM  [also labelled I2C_SCL_CAM]
SCL_SENSOR: R4.1 ; off-sheet I2C_SCL_SENSOR  [also labelled I2C_SCL_SENSOR]
SDA: R1.1 ; off-sheet I2C_SDA_CAM  [also labelled I2C_SDA_CAM]
SDA_SENSOR: R3.1 ; off-sheet I2C_SDA_SENSOR  [also labelled I2C_SDA_SENSOR]
SWDCLK: J1.4 M1.53(SWDCLK)
SWDIO: J1.2 M1.51(SWDIO)
NetC1_1: C1.1 M1.17(P0.00/XL1) X1.2
NetC2_1: C2.1 M1.18(P0.01/XL2) X1.1

Not connected (* = marked no-connect by the designer): J1 7 8; M1 31(DCCH) 34(D-)* 35(D+)* 52(P0.09/NFC1) 54(P0.10/NFC2)

### Notes on the sheet
- SPI-LEPTON
- SPI-ARDUCAM
- Title
- Size
- Date:
- File:
- A3
- PCB Assembly Number
- Sheet         of
- Drawn By:
- Revision
- Classification:

### Library data of the parts
C1-C3 = CC0603KRX7R0BB104: as C6 on sheet solar_power; Datasheet Link: https://www.yageo.com/upload/media/product/products/datasheet/mlcc/UPY-NP0X7R_MV_100-to-630V_21.pdf; Height: 0.9mm; Manufacturer_Part_Number: CC0603KRX7R0BB104; Mouser Part Number: 603-CC603KRX7R0BB104; Mouser Price/Stock: https://www.mouser.co.uk/ProductDetail/YAGEO/CC0603KRX7R0BB104?qs=5eucE5Hus%252BjO6dm3Y8T6pg%3D%3D; Arrow Part Number: CC0603KRX7R0BB104; Arrow Price/Stock: https://www.arrow.com/en/products/cc0603krx7r0bb104/yageo?region=nac
J1 = BD125-10-A-0305-0580-L-B: Connector; Manufacturer_Name: GCT (GLOBAL CONNECTOR TECHNOLOGY); Datasheet Link: https://gct.co/connector/bd125; Height: 6.37mm; Manufacturer_Part_Number: BD125-10-A-0305-0580-L-B; Mouser Part Number: 640-BD12510A305580LB; Mouser Price/Stock: https://www.mouser.co.uk/ProductDetail/GCT/BD125-10-A-0305-0580-L-B?qs=amGC7iS6iy%252BPUE%252B5wV8wFA%3D%3D
M1 = MDBT50Q_52840: MDBT50Q(52840)
R1-R4 = RES: Resistor, ±5%, 1/10W 0603; Part Number: R0201-0R; Manufacturer: N.A.; Part number IPS: 00000003245; Part number NEMS: 100100001; Note: Chip Res 5%; Pad Count: 2; Component Status: Active; Manufacturer Part Number: N.A.; Footprint Doc: 0201; LatestRevisionDate: 2017-11-09; Published: 2014-11-13; Value: 0R; Artikkelnr Noca: N.A.; ComponentLink1URL: N.A.; ComponentLink1Description: Datasheet; ComponentLink2URL: N.A.; ComponentLink2Description: Supplier link; HelpURL: N.A.; Supplier 1: N.A.; Supplier Part Number 1: N.A.; Supplier 2: N.A.; Supplier Part Number 2: N.A.; Component Class: Resistors; PartId: 100100001; Author: rsk; Part number Norautron: N.A.
X1 = FC-135_32.7680KA-A5: Crystal or Oscillator; Manufacturer_Name: Epson Timing; Manufacturer_Part_Number: FC-135 32.7680KA-A5; Datasheet Link: https://support.epson.biz/td/api/doc_check.php?dl=brief_FC-135&lang=en; Height: 0.9mm; Mouser Part Number: 732-532.7680KA-A5; Mouser Price/Stock: https://www.mouser.co.uk/ProductDetail/Epson-Timing/FC-135-32.7680KA-A5?qs=f9yNj16SXrJ7J65t%252BHv0JQ%3D%3D; Arrow Part Number: FC-135 32.7680KA-A5; Arrow Price/Stock: https://www.arrow.com/en/products/fc-13532.7680ka-a5/epson-electronics-america?region=nac

## Nets that join several sheets
3V3: solar_power (10 pins), connectors (C23.2 J5.4 U1.8), nRF52840 (C3.2 J1.1 M1.28 M1.30)
3V3_ARDU: solar_power (5 pins), connectors (J7.3)
3V3_LEPTON: solar_power (5 pins), connectors (J8.20)
GND: solar_power (42 pins), connectors (10 pins), nRF52840 (12 pins)
VBAT: solar_power (7 pins), connectors (C24.2 C25.2 U1.1)
P0.02: solar_power (IC1.3), nRF52840 (M1.11)
P0.03: solar_power (IC3.3 R11.2), nRF52840 (M1.9)
P0.06: connectors (J7.5), nRF52840 (M1.22)
P0.07: connectors (J7.6), nRF52840 (M1.23)
P0.08: connectors (J7.7), nRF52840 (M1.24)
P0.12: connectors (J8.13), nRF52840 (M1.29)
P0.13: connectors (J8.11), nRF52840 (M1.37)
P0.14: connectors (J8.12), nRF52840 (M1.36)
P0.15: connectors (J8.5), nRF52840 (M1.39)
P0.16: connectors (J8.10), nRF52840 (M1.38)
P0.28: solar_power (IC1.9), nRF52840 (M1.13)
P0.29: connectors (R16.2 U1.5), nRF52840 (M1.10)
P0.30: solar_power (IC5.3 R15.2), nRF52840 (M1.14)
P0.31: solar_power (IC2.7 R7.2), nRF52840 (M1.12)
P1.08: connectors (J7.8), nRF52840 (M1.25)
P1.14: connectors (U1.7), nRF52840 (M1.7)
P1.15: connectors (U1.6), nRF52840 (M1.8)
SCL: connectors (J7.1 J8.14), nRF52840 (R2.1)
SCL_SENSOR: connectors (J5.2), nRF52840 (R4.1)
SDA: connectors (J7.2 J8.15), nRF52840 (R1.1)
SDA_SENSOR: connectors (J5.1), nRF52840 (R3.1)